# EAGLE design tes1 (EAGLE 6.2)
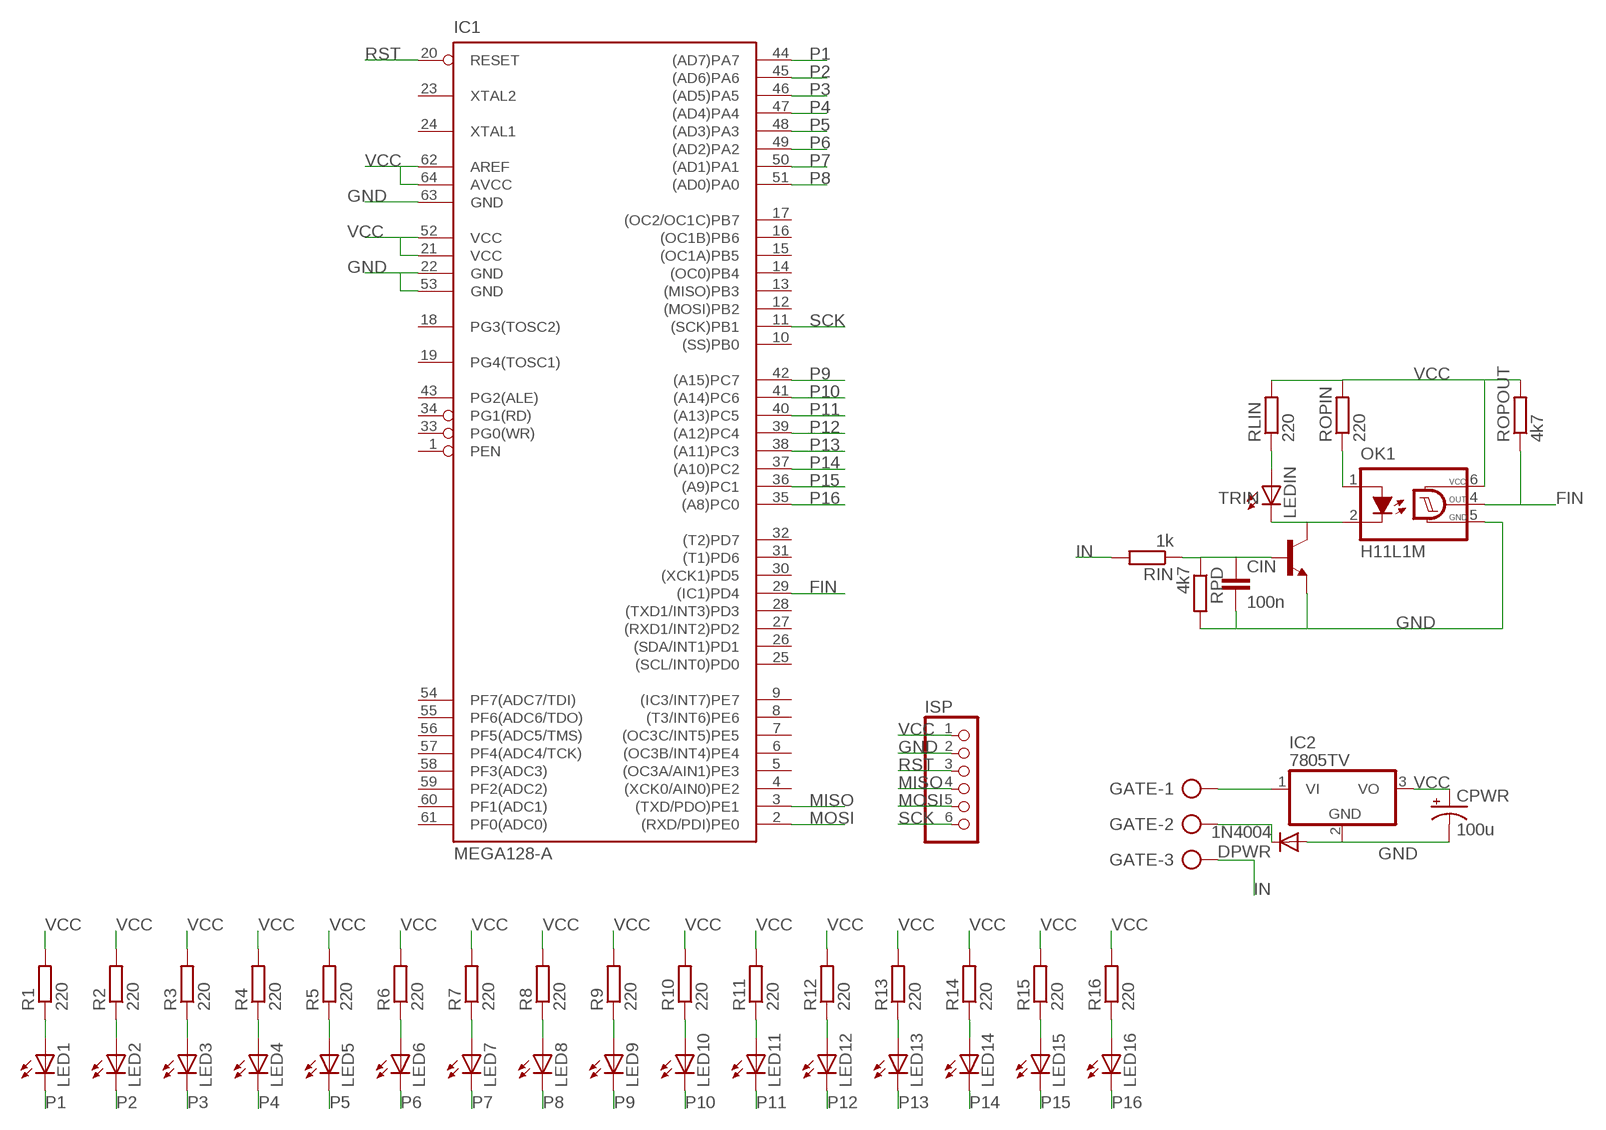
[diagram p0: schematic, sheet 1]

## Parts
CIN  100n  C-EU050-024X044  [C050-024X044]
CPWR  100u  CPOL-USE2-5  [E2-5]
DPWR  1N4004  [DO41-10]
GATE  AK300/3  [AK300/3]
IC1  MEGA128-A  [TQFP64]
IC2  7805TV  [TO220V]
ISP  PINHD-1X6  [1X06]
LED1  LED3MM  [LED3MM]
LED2  LED3MM  [LED3MM]
LED3  LED3MM  [LED3MM]
LED4  LED3MM  [LED3MM]
LED5  LED3MM  [LED3MM]
LED6  LED3MM  [LED3MM]
LED7  LED3MM  [LED3MM]
LED8  LED3MM  [LED3MM]
LED9  LED3MM  [LED3MM]
LED10  LED3MM  [LED3MM]
LED11  LED3MM  [LED3MM]
LED12  LED3MM  [LED3MM]
LED13  LED3MM  [LED3MM]
LED14  LED3MM  [LED3MM]
LED15  LED3MM  [LED3MM]
LED16  LED3MM  [LED3MM]
LEDIN  LED3MM  [LED3MM]
OK1  H11L1M  [DIL06]
R1  220  R-EU_0204/7  [0204/7]
R2  220  R-EU_0204/7  [0204/7]
R3  220  R-EU_0204/7  [0204/7]
R4  220  R-EU_0204/7  [0204/7]
R5  220  R-EU_0204/7  [0204/7]
R6  220  R-EU_0204/7  [0204/7]
R7  220  R-EU_0204/7  [0204/7]
R8  220  R-EU_0204/7  [0204/7]
R9  220  R-EU_0204/7  [0204/7]
R10  220  R-EU_0204/7  [0204/7]
R11  220  R-EU_0204/7  [0204/7]
R12  220  R-EU_0204/7  [0204/7]
R13  220  R-EU_0204/7  [0204/7]
R14  220  R-EU_0204/7  [0204/7]
R15  220  R-EU_0204/7  [0204/7]
R16  220  R-EU_0204/7  [0204/7]
RIN  1k  R-EU_0204/7  [0204/7]
RLIN  220  R-EU_0204/7  [0204/7]
ROPIN  220  R-EU_0204/7  [0204/7]
ROPOUT  4k7  R-EU_0204/7  [0204/7]
RPD  4k7  R-EU_0204/7  [0204/7]
TRIN  -NPN-TO92-EBC  [TO92-EBC]

## Nets
FIN: IC1.29((IC1)PD4) OK1.4(OUT) ROPOUT.1
GND: CIN.2 CPWR.- DPWR.A IC1.22(GND) IC1.53(GND) IC1.63(GND) IC2.2(GND) ISP.2 OK1.5(GND) RPD.2 TRIN.E
IN: GATE.3 RIN.2
MISO: IC1.3((TXD/PDO)PE1) ISP.4
MOSI: IC1.2((RXD/PDI)PE0) ISP.5
N$1: LED2.A R2.1
N$8: LED3.A R3.1
N$9: LED1.A R1.1
N$10: LED4.A R4.1
N$12: LED5.A R5.1
N$13: LED6.A R6.1
N$14: LED7.A R7.1
N$15: LED8.A R8.1
N$16: LED9.A R9.1
N$17: LED10.A R10.1
N$18: LED11.A R11.1
N$19: LED12.A R12.1
N$20: LED13.A R13.1
N$21: LED14.A R14.1
N$22: LED15.A R15.1
N$23: LED16.A R16.1
N$45: DPWR.C GATE.2
N$46: GATE.1 IC2.1(VI)
N$49: CIN.1 RIN.1 RPD.1 TRIN.B
N$50: LEDIN.K(C) OK1.2(C) TRIN.C
N$51: OK1.1(A) ROPIN.1
N$52: LEDIN.A RLIN.1
P1: IC1.44((AD7)PA7) LED1.K(C)
P2: IC1.45((AD6)PA6) LED2.K(C)
P3: IC1.46((AD5)PA5) LED3.K(C)
P4: IC1.47((AD4)PA4) LED4.K(C)
P5: IC1.48((AD3)PA3) LED5.K(C)
P6: IC1.49((AD2)PA2) LED6.K(C)
P7: IC1.50((AD1)PA1) LED7.K(C)
P8: IC1.51((AD0)PA0) LED8.K(C)
P9: IC1.42((A15)PC7) LED9.K(C)
P10: IC1.41((A14)PC6) LED10.K(C)
P11: IC1.40((A13)PC5) LED11.K(C)
P12: IC1.39((A12)PC4) LED12.K(C)
P13: IC1.38((A11)PC3) LED13.K(C)
P14: IC1.37((A10)PC2) LED14.K(C)
P15: IC1.36((A9)PC1) LED15.K(C)
P16: IC1.35((A8)PC0) LED16.K(C)
RST: IC1.20(RESET) ISP.3
SCK: IC1.11((SCK)PB1) ISP.6
VCC: CPWR.+ IC1.21(VCC) IC1.52(VCC) IC1.62(AREF) IC1.64(AVCC) IC2.3(VO) ISP.1 OK1.6(VCC) R1.2 R2.2 R3.2 R4.2 R5.2 R6.2 R7.2 R8.2 R9.2 R10.2 R11.2 R12.2 R13.2 R14.2 R15.2 R16.2 RLIN.2 ROPIN.2 ROPOUT.2
Unconnected: IC1.1(PEN) IC1.4((XCK0/AIN0)PE2) IC1.5((OC3A/AIN1)PE3) IC1.6((OC3B/INT4)PE4) IC1.7((OC3C/INT5)PE5) IC1.8((T3/INT6)PE6) IC1.9((IC3/INT7)PE7) IC1.10((SS)PB0) IC1.12((MOSI)PB2) IC1.13((MISO)PB3) IC1.14((OC0)PB4) IC1.15((OC1A)PB5) IC1.16((OC1B)PB6) IC1.17((OC2/OC1C)PB7) IC1.18(PG3(TOSC2)) IC1.19(PG4(TOSC1)) IC1.23(XTAL2) IC1.24(XTAL1) IC1.25((SCL/INT0)PD0) IC1.26((SDA/INT1)PD1) IC1.27((RXD1/INT2)PD2) IC1.28((TXD1/INT3)PD3) IC1.30((XCK1)PD5) IC1.31((T1)PD6) IC1.32((T2)PD7) IC1.33(PG0(WR)) IC1.34(PG1(RD)) IC1.43(PG2(ALE)) IC1.54(PF7(ADC7/TDI)) IC1.55(PF6(ADC6/TDO)) IC1.56(PF5(ADC5/TMS)) IC1.57(PF4(ADC4/TCK)) IC1.58(PF3(ADC3)) IC1.59(PF2(ADC2)) IC1.60(PF1(ADC1)) IC1.61(PF0(ADC0))

## Library data of the parts
CIN = resistor:C-EU: CAPACITOR, European symbol
CPWR = resistor:CPOL-US: POLARIZED CAPACITOR, American symbol
DPWR = diode:1N4004: DIODE general purpose rectifier, 1 A
GATE = con-ptr500:AK300/3: CONNECTOR; OC_FARNELL: unknown; OC_NEWARK: unknown
IC1 = atmel:MEGA128: MICROCONTROLLER 128 Kbytes FLASH 4 Kbytes SRAM 4 Kbytes EEPROM DUAL USART 8-channel 10 bit ADC Source: avr.lbr; MPN: ATMEGA128-16AU; OC_FARNELL: 9171118; OC_NEWARK: 95K7364
IC2 = linear:78*: Positive VOLTAGE REGULATOR Source: http://cache.national.com/ds/LM/LM78L05.pdf http://www.fairchildsemi.com/ds/LM/LM7805.pdf
ISP = pinhead:PINHD-1X6: PIN HEADER
LED1-LED16 LEDIN = led:LED: LED OSRAM: - CHIPLED LG R971, LG N971, LY N971, LG Q971, LY Q971, LO R971, LY R971 LH N974, LH R974 LS Q976, LO Q976, LY Q976 LO Q996 - Hyper CHIPLED LW Q18S LB Q993, LB Q99A, LB R99A - SideLED LS A670, LO A670, LY A670, LG A670, LP A670 LB A673, LV A673, LT A673, LW A673 LH A674 LY A675 LS A676, LA A676, LO A676, LY A676, LW A676 LS A679, LY A679, LG A679 - Hyper Micro SIDELED® LS Y876, LA Y876, LO Y876, LY Y876 LT Y87S - SmartLED LW L88C, LW L88S LB L89C, LB L89S, LG L890 LS L89K, LO L89K, LY L89K LS L896, LA L896, LO L896, LY L896 - TOPLED LS T670, LO T670, LY T670, LG T670, LP T670 LSG T670, LSP T670, LSY T670, LOP T670, LYG T670 LG T671, LOG T671, LSG T671 LB T673, LV T673, LT T673, LW T673 LH T674 LS T676, LA T676, LO T676, LY T676, LB T676, LH T676, LSB T676, LW T676 LB T67C, LV T67C, LT T67C, LS T67K, LO T67K, LY T67K, LW E67C LS E67B, LA E67B, LO E67B, LY E67B, LB E67C, LV E67C, LT E67C LW T67C LS T679, LY T679, LG T679 LS T770, LO T770, LY T770, LG T770, LP T770 LB T773, LV T773, LT T773, LW T773 LH T774 LS E675, LA E675, LY E675, LS T675 LS T776, LA T776, LO T776, LY T776, LB T776 LHGB T686 LT T68C, LB T68C - Hyper Mini TOPLED® LB M676 - Mini TOPLED Santana® LG M470 LS M47K, LO M47K, LY M47K Source: http://www.osram.convergy.de LUXEON: - LUMILED® LXK2-PW12-R00, LXK2-PW12-S00, LXK2-PW14-U00, LXK2-PW14-V00 LXK2-PM12-R00, LXK2-PM12-S00, LXK2-PM14-U00 LXK2-PE12-Q00, LXK2-PE12-R00, LXK2-PE12-S00, LXK2-PE14-T00, LXK2-PE14-U00 LXK2-PB12-K00, LXK2-PB12-L00, LXK2-PB12-M00, LXK2-PB14-N00, LXK2-PB14-P00, LXK2-PB14-Q00 LXK2-PR12-L00, LXK2-PR12-M00, LXK2-PR14-Q00, LXK2-PR14-R00 LXK2-PD12-Q00, LXK2-PD12-R00, LXK2-PD12-S00 LXK2-PH12-R00, LXK2-PH12-S00 LXK2-PL12-P00, LXK2-PL12-Q00, LXK2-PL12-R00 Source: www.luxeon.com KINGBRIGHT: KA-3528ASYC Source: www.kingbright.com
OK1 = optocoupler:H11L*M: 6-Pin DIP Optocoupler Source: http://www.fairchildsemi.com/ds/H1/H11L2-M.pdf; MF: FAIRCHILD SEMICONDUCTOR; MPN: H11L1-M; OC_FARNELL: 1021127; OC_NEWARK: 72K8643
R1-R16 RIN RLIN ROPIN ROPOUT RPD = resistor:R-EU_: RESISTOR, European symbol
TRIN = transistor:*-NPN-: NPN Transistror BF959 corrected 2008.03.06

## Board
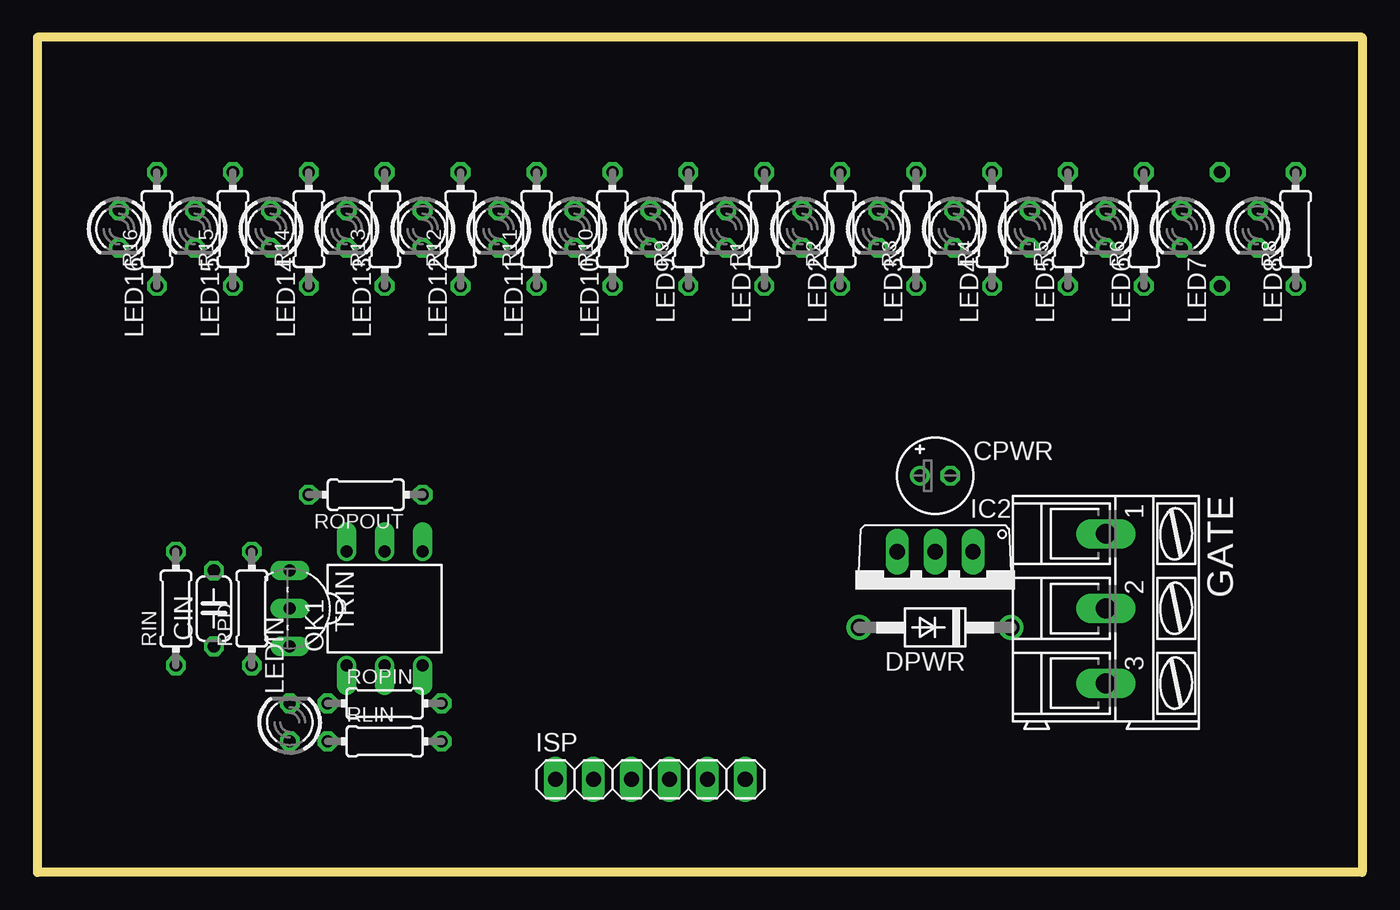
[diagram p1: board, top side]
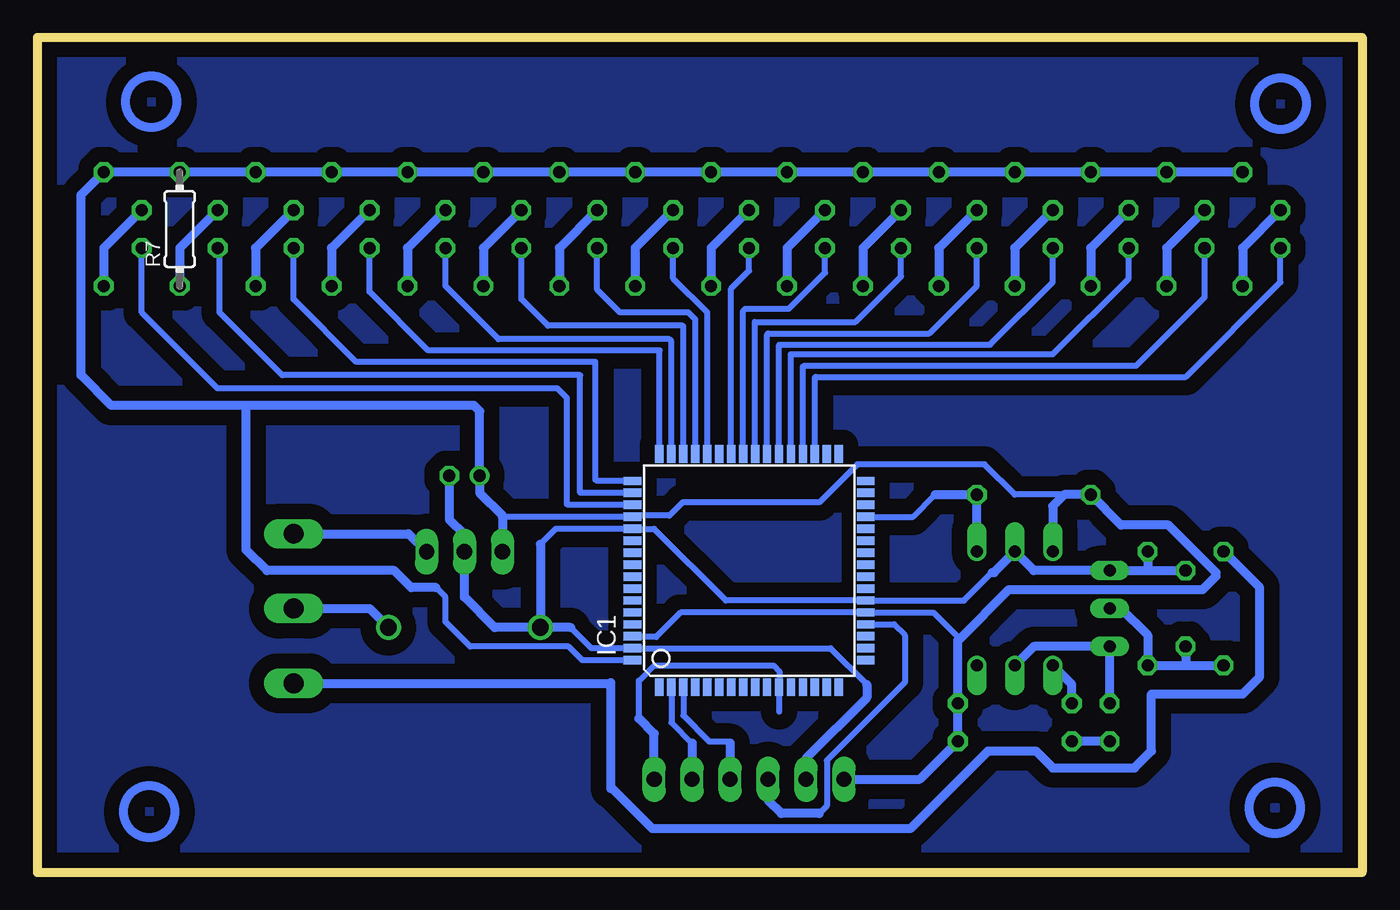
[diagram p2: board, bottom side, seen from below]

Size 88.65 x 55.88 mm. Coordinates in mm from the lower left corner, seen from the top.
Outline: 88.65,55.88 88.65,0 0,0 0,55.88 88.65,55.88
Copper layers (1*16): Top 0.035mm / dielectric 1.5mm / Bottom 0.035mm
Design rules: minimum track width 10mil, minimum drill 24mil, track to track 8mil, track to pad 8mil, pad to pad 8mil, via to via 8mil, smd to smd 8mil, copper to edge 40mil, drill to drill 8mil, minimum pad ring 10mil, minimum via ring 8mil, stop-mask expansion 4mil, vias tented up to drill 0mil, thermal gap 10mil

### Footprints (pad centres in the part's own frame; a part is rotated, then mirrored left to right if it is on the bottom)
C050-024X044 = drill 0.813 octagon: 1 -2.54,0; 2 2.54,0
E2-5 = drill 0.813 pad 1.27: + -1.016,0 | drill 0.813 pad 1.27 octagon: - 1.016,0
DO41-10 = drill 1.118: A 5.08,0; C -5.08,0
AK300/3 = drill 1.321 long: 1 -5.004,0; 2 0,0; 3 5.004,0
TQFP64 = smd 1.194 x 0.559: 1 -7.8,6; 2 -7.8,5.2; 3 -7.8,4.4; 4 -7.8,3.6; 5 -7.8,2.8; 6 -7.8,2; 7 -7.8,1.2; 8 -7.8,0.4; 9 -7.8,-0.4; 10 -7.8,-1.2; 11 -7.8,-2; 12 -7.8,-2.8; 13 -7.8,-3.6; 14 -7.8,-4.4; 15 -7.8,-5.2; 16 -7.8,-6; 33 7.8,-6; 34 7.8,-5.2; 35 7.8,-4.4; 36 7.8,-3.6; 37 7.8,-2.8; 38 7.8,-2; 39 7.8,-1.2; 40 7.8,-0.4; 41 7.8,0.4; 42 7.8,1.2; 43 7.8,2; 44 7.8,2.8; 45 7.8,3.6; 46 7.8,4.4; 47 7.8,5.2; 48 7.8,6 | smd 0.559 x 1.194: 17 -6,-7.8; 18 -5.2,-7.8; 19 -4.4,-7.8; 20 -3.6,-7.8; 21 -2.8,-7.8; 22 -2,-7.8; 23 -1.2,-7.8; 24 -0.4,-7.8; 25 0.4,-7.8; 26 1.2,-7.8; 27 2,-7.8; 28 2.8,-7.8; 29 3.6,-7.8; 30 4.4,-7.8; 31 5.2,-7.8; 32 6,-7.8; 49 6,7.8; 50 5.2,7.8; 51 4.4,7.8; 52 3.6,7.8; 53 2.8,7.8; 54 2,7.8; 55 1.2,7.8; 56 0.4,7.8; 57 -0.4,7.8; 58 -1.2,7.8; 59 -2,7.8; 60 -2.8,7.8; 61 -3.6,7.8; 62 -4.4,7.8; 63 -5.2,7.8; 64 -6,7.8
TO220V = drill 1.016 long: 1 -2.54,-2.54; 2 0,-2.54; 3 2.54,-2.54
1X06 = drill 1.016 long: 1 -6.35,0; 2 -3.81,0; 3 -1.27,0; 4 1.27,0; 5 3.81,0; 6 6.35,0
LED3MM = drill 0.813 octagon: A -1.27,0; K 1.27,0
DIL06 = drill 0.813 offset: 1 -2.54,-3.81; 2 0,-3.81; 3 2.54,-3.81; 4 2.54,3.81; 5 0,3.81; 6 -2.54,3.81
0204/7 = drill 0.813 octagon: 1 -3.81,0; 2 3.81,0
TO92-EBC = drill 0.813 long: B 0,-1.27; C 2.54,-1.27; E -2.54,-1.27

### Placement (x,y rotation side)
CIN  11.81,17.65 90 top
CPWR  60.07,26.54 0 top
DPWR  60.07,16.38 180 top
GATE  71.5,17.65 270 top
IC1  41.02,20.19 90 bottom
IC2  60.07,18.92 180 top
ISP  41.02,6.22 0 top
LED1  46.1,43.05 270 top
LED2  51.18,43.05 270 top
LED3  56.26,43.05 270 top
LED4  61.34,43.05 270 top
LED5  66.42,43.05 270 top
LED6  71.5,43.05 270 top
LED7  76.58,43.05 270 top
LED8  81.66,43.05 270 top
LED9  41.02,43.05 270 top
LED10  35.94,43.05 270 top
LED11  30.86,43.05 270 top
LED12  25.78,43.05 270 top
LED13  20.7,43.05 270 top
LED14  15.62,43.05 270 top
LED15  10.54,43.05 270 top
LED16  5.46,43.05 270 top
LEDIN  16.89,10.03 90 top
OK1  23.24,17.65 0 top
R1  48.64,43.05 90 top
R2  53.72,43.05 90 top
R3  58.8,43.05 90 top
R4  63.88,43.05 90 top
R5  68.96,43.05 90 top
R6  74.04,43.05 90 top
R7  79.12,43.05 90 bottom
R8  84.2,43.05 90 top
R9  43.56,43.05 90 top
R10  38.48,43.05 90 top
R11  33.4,43.05 90 top
R12  28.32,43.05 90 top
R13  23.24,43.05 90 top
R14  18.16,43.05 90 top
R15  13.08,43.05 90 top
R16  8,43.05 90 top
RIN  9.27,17.65 90 top
RLIN  23.24,8.76 0 top
ROPIN  23.24,11.3 0 top
ROPOUT  21.97,25.27 180 top
RPD  14.35,17.65 90 top
TRIN  18.16,17.65 270 top

### Tracks (layer width: path | path; a pad name or v marks a point on that pad's centre or on a via)
FIN
  Bottom 0.406: IC1.29 30.05,23.79 28.57,25.27
  Bottom 0.61: OK1.4 ROPOUT.1 28.57,25.27
GND
  Bottom 0.406: 52.96,16.38 51.57,14.99 IC1.63 35.57,14.99 33.15,12.57 | 24.76,20.07 26.64,18.19 IC1.22 42.58,18.19 47.38,22.99 IC1.53 53.97,22.99 54.99,21.97
  Bottom 0.61: CPWR.- 61.09,23.62 60.07,22.61 IC2.2 60.07,18.41 58.04,16.38 DPWR.A | 14.35,20.19 TRIN.E 21.97,20.19 OK1.5 24.64,20.07 24.76,20.07 | 14.35,20.19 CIN.2 | RPD.2 14.35,20.19 | 52.96,16.38 DPWR.A | 54.99,21.97 DPWR.A | 33.15,12.57 33.15,11.68 37.21,7.62 ISP.2
IN
  Bottom 0.61: GATE.3 50.34,12.65 50.29,12.7 50.29,5.71 | 50.29,5.71 50.29,5.59 | RIN.2 6.86,19.05 6.86,13.08 8,11.94 14.1,11.94 14.1,8.13 15.24,6.98 20.7,6.98 21.84,8.13 25.02,8.13 30.23,2.92 47.5,2.92 50.29,5.71
MISO
  Bottom 0.406: IC1.3 45.42,10.5 43.69,8.76 42.42,8.76 42.29,8.64
  Bottom 0.61: 42.29,8.64 ISP.4
MOSI
  Bottom 0.406: IC1.2 46.22,10.03 44.83,8.64
  Bottom 0.61: 44.83,8.64 ISP.5
N$1
  Bottom 0.61: LED2.A 53.72,41.78 R2.1
N$2
  pour Bottom (isolate 1.016): 0,55.88 88.65,55.88 88.65,0 0,0
N$8
  Bottom 0.61: LED3.A 58.8,41.78 R3.1
N$9
  Bottom 0.61: LED1.A 48.64,41.78 R1.1
N$10
  Bottom 0.61: LED4.A 63.88,41.78 R4.1
N$12
  Bottom 0.61: LED5.A 68.96,41.78 R5.1
N$13
  Bottom 0.61: LED6.A 74.04,41.78 R6.1
N$14
  Bottom 0.61: LED7.A 79.12,41.78 R7.1
N$15
  Bottom 0.61: LED8.A 84.2,41.78 R8.1
N$16
  Bottom 0.61: LED9.A 43.56,41.78 R9.1
N$17
  Bottom 0.61: LED10.A 38.48,41.78 R10.1
N$18
  Bottom 0.61: LED11.A 33.4,41.78 R11.1
N$19
  Bottom 0.61: LED12.A 28.32,41.78 R12.1
N$20
  Bottom 0.61: LED13.A 23.24,41.78 R13.1
N$21
  Bottom 0.61: LED14.A 18.16,41.78 R14.1
N$22
  Bottom 0.61: LED15.A 13.08,41.78 R15.1
N$23
  Bottom 0.61: LED16.A 8,41.78 R16.1
N$45
  Bottom 0.61: GATE.2 66.42,17.65 DPWR.C
N$46
  Bottom 0.61: GATE.1 63.81,22.66 IC2.1
N$49
  Bottom 0.61: TRIN.B 16.13,17.65 14.35,15.88 RPD.1 11.94,13.84 | 11.94,13.84 RIN.1 | CIN.1 11.81,13.97 11.94,13.84
N$50
  Bottom 0.61: LEDIN.K TRIN.C 21.97,15.11 OK1.2
N$51
  Bottom 0.61: ROPIN.1 19.43,12.57 OK1.1
N$52
  Bottom 0.61: LEDIN.A RLIN.1
P1
  Bottom 0.406: IC1.44 43.82,37.47 46.1,39.75 LED1.K
P2
  Bottom 0.406: IC1.45 44.62,37 45.09,37.46 49.66,37.46 51.18,38.99 LED2.K
P3
  Bottom 0.406: IC1.46 45.42,36.53 45.47,36.58 54.48,36.58 56.26,38.35 LED3.K
P4
  Bottom 0.406: IC1.47 46.22,35.55 46.36,35.69 57.78,35.69 61.34,39.24 LED4.K
P5
  Bottom 0.406: IC1.48 47.02,34.89 46.99,34.92 62.48,34.92 66.42,38.86 LED5.K
P6
  Bottom 0.406: IC1.49 51.21,26.19 51.31,26.29 51.31,34.16 67.31,34.16 71.5,38.35 LED6.K
P7
  Bottom 0.406: IC1.50 52.32,25.39 52.32,25.4 52.32,33.27 72.26,33.27 76.45,37.46 76.45,41.66 LED7.K
P8
  Bottom 0.406: IC1.51 53.17,24.59 53.21,24.64 53.21,31.75 53.85,32.38 76.58,32.38 81.66,37.46 LED8.K
P9
  Bottom 0.406: IC1.42 42.22,39.06 41.02,40.26 LED9.K
P10
  Bottom 0.406: IC1.41 41.42,37.57 41.28,37.72 38.35,37.72 35.94,40.13 LED10.K
P11
  Bottom 0.406: IC1.40 40.62,36.81 40.64,36.83 33.91,36.83 30.86,39.88 LED11.K
P12
  Bottom 0.406: IC1.39 39.82,36 39.75,36.07 28.96,36.07 25.78,39.24 LED12.K
P13
  Bottom 0.406: IC1.38 39.02,35.27 38.99,35.31 24.89,35.31 20.7,39.5 LED13.K
P14
  Bottom 0.406: IC1.37 38.22,34.66 38.23,34.67 20.7,34.67 15.62,39.75 LED14.K
P15
  Bottom 0.406: IC1.36 37.42,33.83 37.34,33.91 15.11,33.91 10.54,38.48 LED15.K
P16
  Bottom 0.406: IC1.35 36.62,33.1 36.58,33.15 11.81,33.15 5.46,39.5 LED16.K
RST
  Bottom 0.406: IC1.20 31.32,16.59 30.61,15.88 30.61,12.7 35.81,7.49 35.81,4.45 36.32,3.94
  Bottom 0.61: 36.32,3.94 38.86,3.94 39.75,4.83 ISP.3
SCK
  Bottom 0.406: 39.02,10.76 IC1.11 38.99,12.43 38.99,13.46 39.37,13.84 47.37,13.84 48.39,12.83 48.39,10.29
  Bottom 0.61: ISP.6 47.37,9.27 48.39,10.29
VCC
  Bottom 0: 47.24,15.75 45.59,17.4 28.7,17.4 28.7,17.27 27.05,15.62 26.67,15.62 23.5,18.8 10.79,18.8 9.78,19.81 9.78,20.19 12.83,23.24 16.13,23.24
  Bottom 0.406: 57.53,23.75 57.49,23.79 IC1.52 48.74,23.88 46.36,23.88 45.47,24.77 36.32,24.77 33.78,27.3 25.27,27.3 23.24,25.27 ROPOUT.2 | 26.92,15.62 28.7,17.39 IC1.21 45.6,17.39 47.24,15.75 48.78,15.75 IC1.62 | IC1.64 52.17,14.19 53.09,15.11 59.69,15.11 61.34,16.76 61.34,18.41 61.98,19.05
  Bottom 0.61: R16.2 R15.2 R14.2 R13.2 R12.2 R11.2 R10.2 R9.2 R1.2 R2.2 R3.2 R4.2 R5.2 R6.2 R7.2 R8.2 85.73,45.34 85.73,33.27 83.69,31.24 74.68,31.24 | IC2.3 57.53,23.75 57.53,23.88 59.06,25.4 CPWR.+ 59.06,30.86 59.44,31.24 74.68,31.24 | ISP.1 29.59,6.22 RLIN.2 ROPIN.2 27.05,15.49 26.92,15.62 23.62,18.92 10.67,18.92 9.78,19.81 9.78,20.07 12.95,23.24 16.13,23.24 ROPOUT.2 19.94,25.27 20.7,24.51 OK1.6 | 61.98,19.05 63.63,19.05 64.77,20.19 73.28,20.19 74.68,21.59 74.68,31.24
(copper drawn outside any net)
  shapes: Bottom circle x4